# EAGLE design AJH_2v_v1_03 (EAGLE 9.5.2)

## Sheet 1 of 3
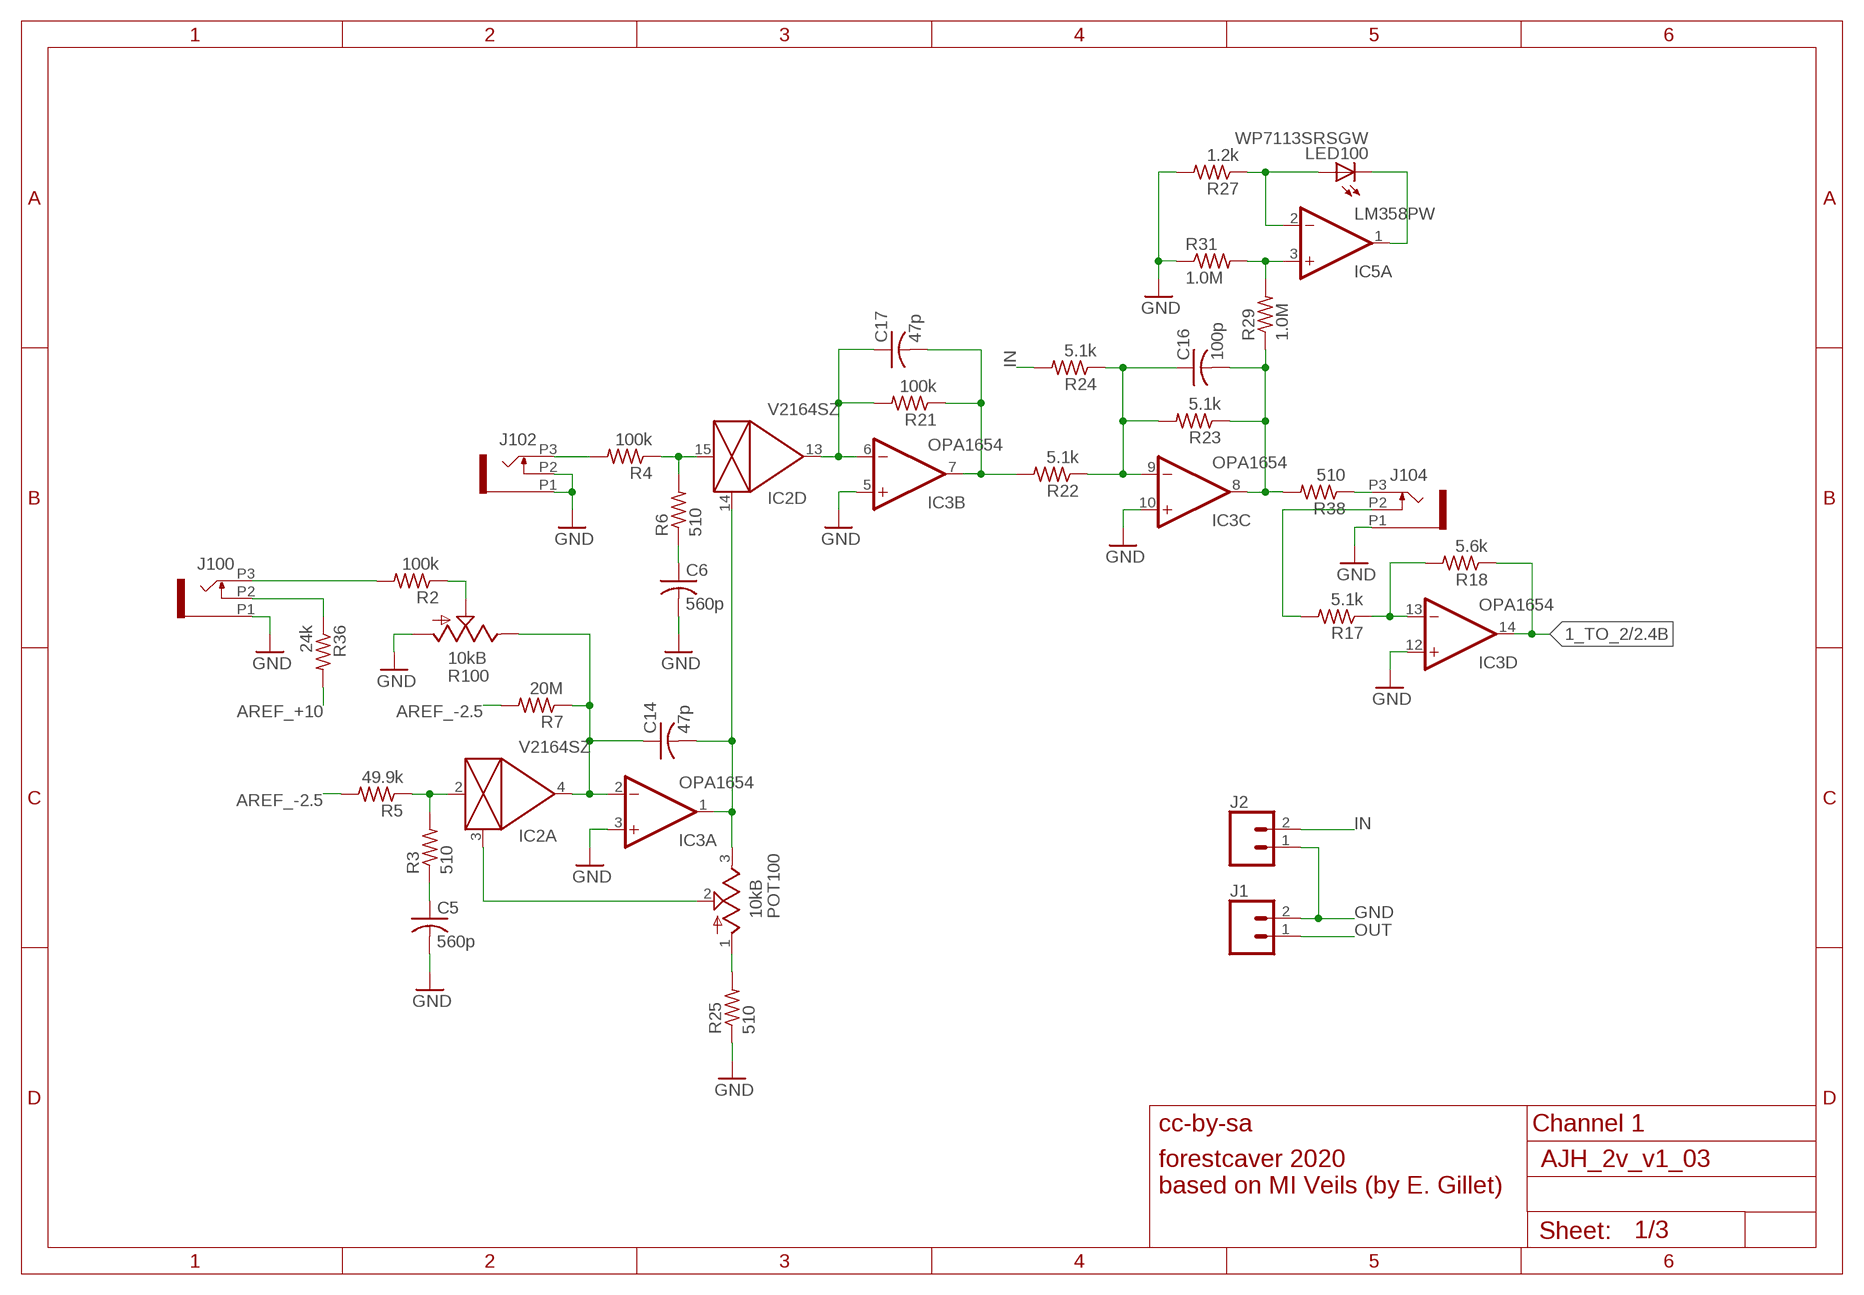
[diagram p0: schematic, sheet 1]

### Parts
C5  560p  C-USC0402  [C0402]
C6  560p  C-USC0402  [C0402]
C14  47p  C-USC0402  [C0402]
C16  100p  C-USC0402  [C0402]
C17  47p  C-USC0402  [C0402]
IC2  V2164SZ  SSM2164S  [SOIC16N]
IC3  OPA1654  TL074PW  [TSSOP14]
IC5  LM358PW  TL072PW  [TSSOP8]
J1  CONN_02  [1X02]
J2  CONN_02  [1X02]
J100  PJ301_THONKICONN6  [WQP_PJ_301M6]
J102  PJ301_THONKICONN6  [WQP_PJ_301M6]
J104  PJ301_THONKICONN6  [WQP_PJ_301M6]
LED100  WP7113SRSGW  LED5MM  [LED5MM]
POT100  10kB  POT_VERTICALNOHOLE  [ALPS_POT_NOHOLE]
R2  100k  R-US_R0402  [R0402]
R3  510  R-US_R0402  [R0402]
R4  100k  R-US_R0402  [R0402]
R5  49.9k  R-US_R0402  [R0402]
R6  510  R-US_R0402  [R0402]
R7  20M  R-US_R0402  [R0402]
R17  5.1k  R-US_R0402  [R0402]
R18  5.6k  R-US_R0402  [R0402]
R21  100k  R-US_R0402  [R0402]
R22  5.1k  R-US_R0402  [R0402]
R23  5.1k  R-US_R0402  [R0402]
R24  5.1k  R-US_R0402  [R0402]
R25  510  R-US_R0402  [R0402]
R27  1.2k  R-US_R0402  [R0402]
R29  1.0M  R-US_R0402  [R0402]
R31  1.0M  R-US_R0402  [R0402]
R36  24k  R-US_R0402  [R0402]
R38  510  R-US_R0402  [R0402]
R100  10kB  POT_USVERTICAL_PS  [ALPS_POT_VERTICAL_PS]

### Nets
1_TO_2: IC3.14(D:OUT) R18.1 ; also sheet 2
AREF_+10: R36.2 ; also sheet 2,3
AREF_-2.5: R5.2 R7.2 ; also sheet 2,3
CV_IN_1: J100.P3 R2.2
FOO: IC2.2(A:IN) R3.2 R5.1
GND: C5.2 C6.2 IC3.3(A:+IN) IC3.5(B:+IN) IC3.10(C:+IN) IC3.12(D:+IN) J1.2 J2.1 J100.P1 J102.P1 J102.P2 J104.P1 R25.1 R27.2 R31.1 R100.P$3(A) ; also sheet 2,3
IN: J2.2 R24.2
N$1: IC5.3(A:+IN) R29.2 R31.2
N$7: J104.P3 R38.1
N$9: IC2.3(A:CTRL) POT100.2(W)
N$10: C16.1 IC3.9(C:-IN) R22.1 R23.2 R24.1
N$14: R2.1 R100.P$2(S)
N$15: POT100.1(A) R25.2
N$18: IC5.1(A:OUT) LED100.K(C)
N$19: IC5.2(A:-IN) LED100.A R27.1
N$20: C5.1 R3.1
N$21: J100.P2 R36.1
N$22: IC3.13(D:-IN) R17.1 R18.2
N$25: J104.P2 R17.2
N$47: C6.1 R6.1
N$65: C14.1 IC2.4(A:OUT) IC3.2(A:-IN) R7.1 R100.P$1(E)
N$66: J102.P3 R4.2
N$75: IC2.15(D:IN) R4.1 R6.2
N$87: C14.2 IC2.14(D:CTRL) IC3.1(A:OUT) POT100.3(B)
N$96: C17.1 IC2.13(D:OUT) IC3.6(B:-IN) R21.2
N$100: C17.2 IC3.7(B:OUT) R21.1 R22.2
OUT: J1.1 ; also sheet 2
OUT1: C16.2 IC3.8(C:OUT) R23.1 R29.1 R38.2

### Notes on the sheet
- cc-by-sa | Channel 1
- forestcaver 2020
  based on MI Veils (by E. Gillet)

## Sheet 2 of 3
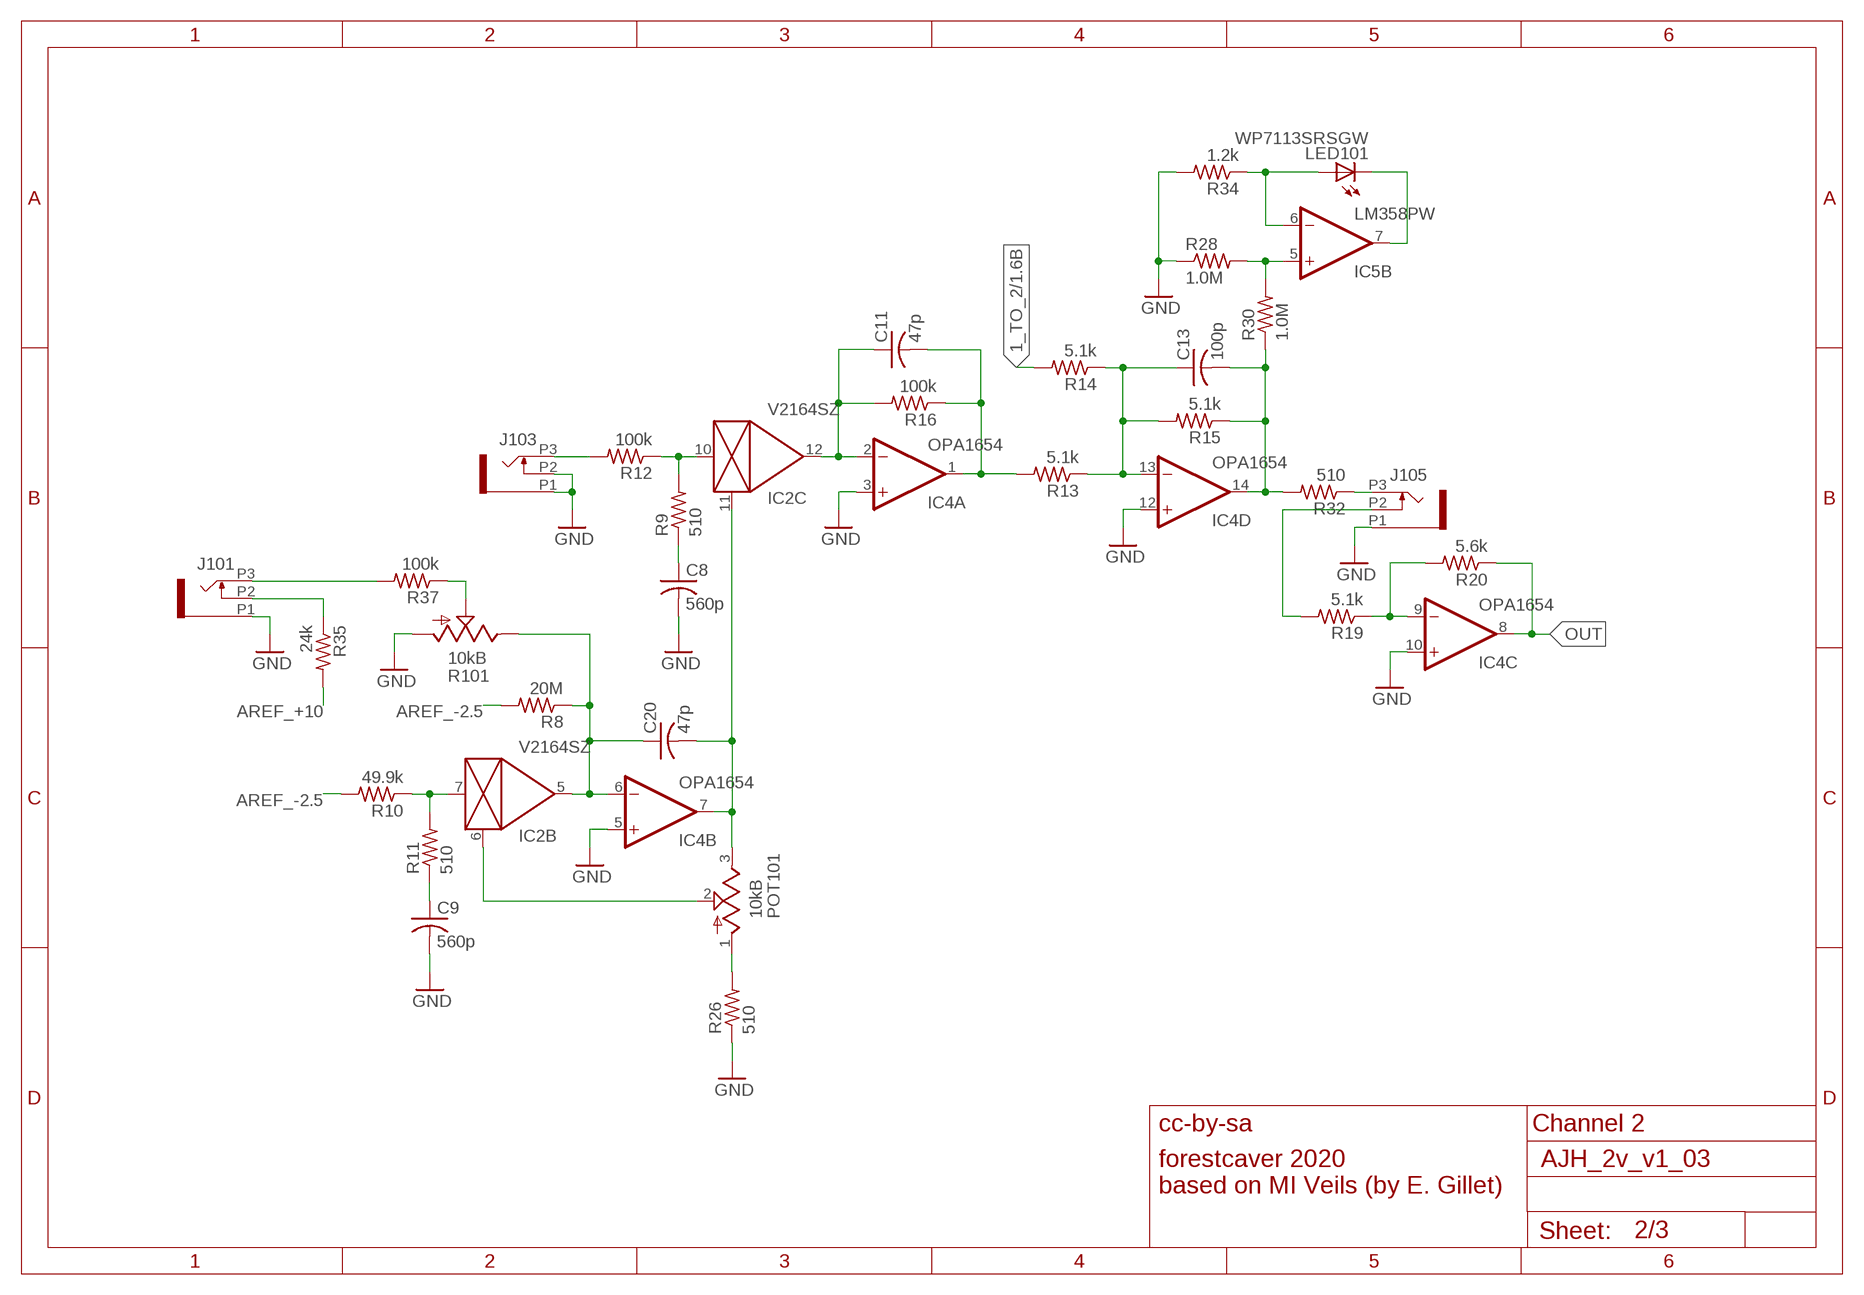
[diagram p1: schematic, sheet 2]

### Parts
C8  560p  C-USC0402  [C0402]
C9  560p  C-USC0402  [C0402]
C11  47p  C-USC0402  [C0402]
C13  100p  C-USC0402  [C0402]
C20  47p  C-USC0402  [C0402]
IC4  OPA1654  TL074PW  [TSSOP14]
J101  PJ301_THONKICONN6  [WQP_PJ_301M6]
J103  PJ301_THONKICONN6  [WQP_PJ_301M6]
J105  PJ301_THONKICONN6  [WQP_PJ_301M6]
LED101  WP7113SRSGW  LED5MM  [LED5MM]
POT101  10kB  POT_VERTICALNOHOLE  [ALPS_POT_NOHOLE]
R8  20M  R-US_R0402  [R0402]
R9  510  R-US_R0402  [R0402]
R10  49.9k  R-US_R0402  [R0402]
R11  510  R-US_R0402  [R0402]
R12  100k  R-US_R0402  [R0402]
R13  5.1k  R-US_R0402  [R0402]
R14  5.1k  R-US_R0402  [R0402]
R15  5.1k  R-US_R0402  [R0402]
R16  100k  R-US_R0402  [R0402]
R19  5.1k  R-US_R0402  [R0402]
R20  5.6k  R-US_R0402  [R0402]
R26  510  R-US_R0402  [R0402]
R28  1.0M  R-US_R0402  [R0402]
R30  1.0M  R-US_R0402  [R0402]
R32  510  R-US_R0402  [R0402]
R34  1.2k  R-US_R0402  [R0402]
R35  24k  R-US_R0402  [R0402]
R37  100k  R-US_R0402  [R0402]
R101  10kB  POT_USVERTICAL_PS  [ALPS_POT_VERTICAL_PS]

### Nets
1_TO_2: R14.2 ; also sheet 1
AREF_+10: R35.2 ; also sheet 1,3
AREF_-2.5: R8.2 R10.2 ; also sheet 1,3
FOO1: IC2.7(B:IN) R10.1 R11.2
GND: C8.2 C9.2 IC4.3(A:+IN) IC4.5(B:+IN) IC4.10(C:+IN) IC4.12(D:+IN) J101.P1 J103.P1 J103.P2 J105.P1 R26.1 R28.1 R34.2 R101.P$3(A) ; also sheet 1,3
N$3: J103.P3 R12.2
N$4: IC5.5(B:+IN) R28.2 R30.2
N$6: J105.P3 R32.1
N$17: C8.1 R9.1
N$24: IC2.10(C:IN) R9.2 R12.1
N$26: IC2.6(B:CTRL) POT101.2(W)
N$27: C13.1 IC4.13(D:-IN) R13.1 R14.1 R15.2
N$28: C20.2 IC2.11(C:CTRL) IC4.7(B:OUT) POT101.3(B)
N$32: POT101.1(A) R26.2
N$35: IC5.7(B:OUT) LED101.K(C)
N$36: IC5.6(B:-IN) LED101.A R34.1
N$37: IC4.9(C:-IN) R19.1 R20.2
N$38: J105.P2 R19.2
N$39: C11.2 IC4.1(A:OUT) R13.2 R16.1
N$40: R37.1 R101.P$2(S)
N$41: C9.1 R11.1
N$42: C20.1 IC2.5(B:OUT) IC4.6(B:-IN) R8.1 R101.P$1(E)
N$44: J101.P3 R37.2
N$53: C11.1 IC2.12(C:OUT) IC4.2(A:-IN) R16.2
N$64: J101.P2 R35.1
OUT: IC4.8(C:OUT) R20.1 ; also sheet 1
OUT2: C13.2 IC4.14(D:OUT) R15.1 R30.1 R32.2

### Notes on the sheet
- cc-by-sa | Channel 2
- forestcaver 2020
  based on MI Veils (by E. Gillet)

## Sheet 3 of 3
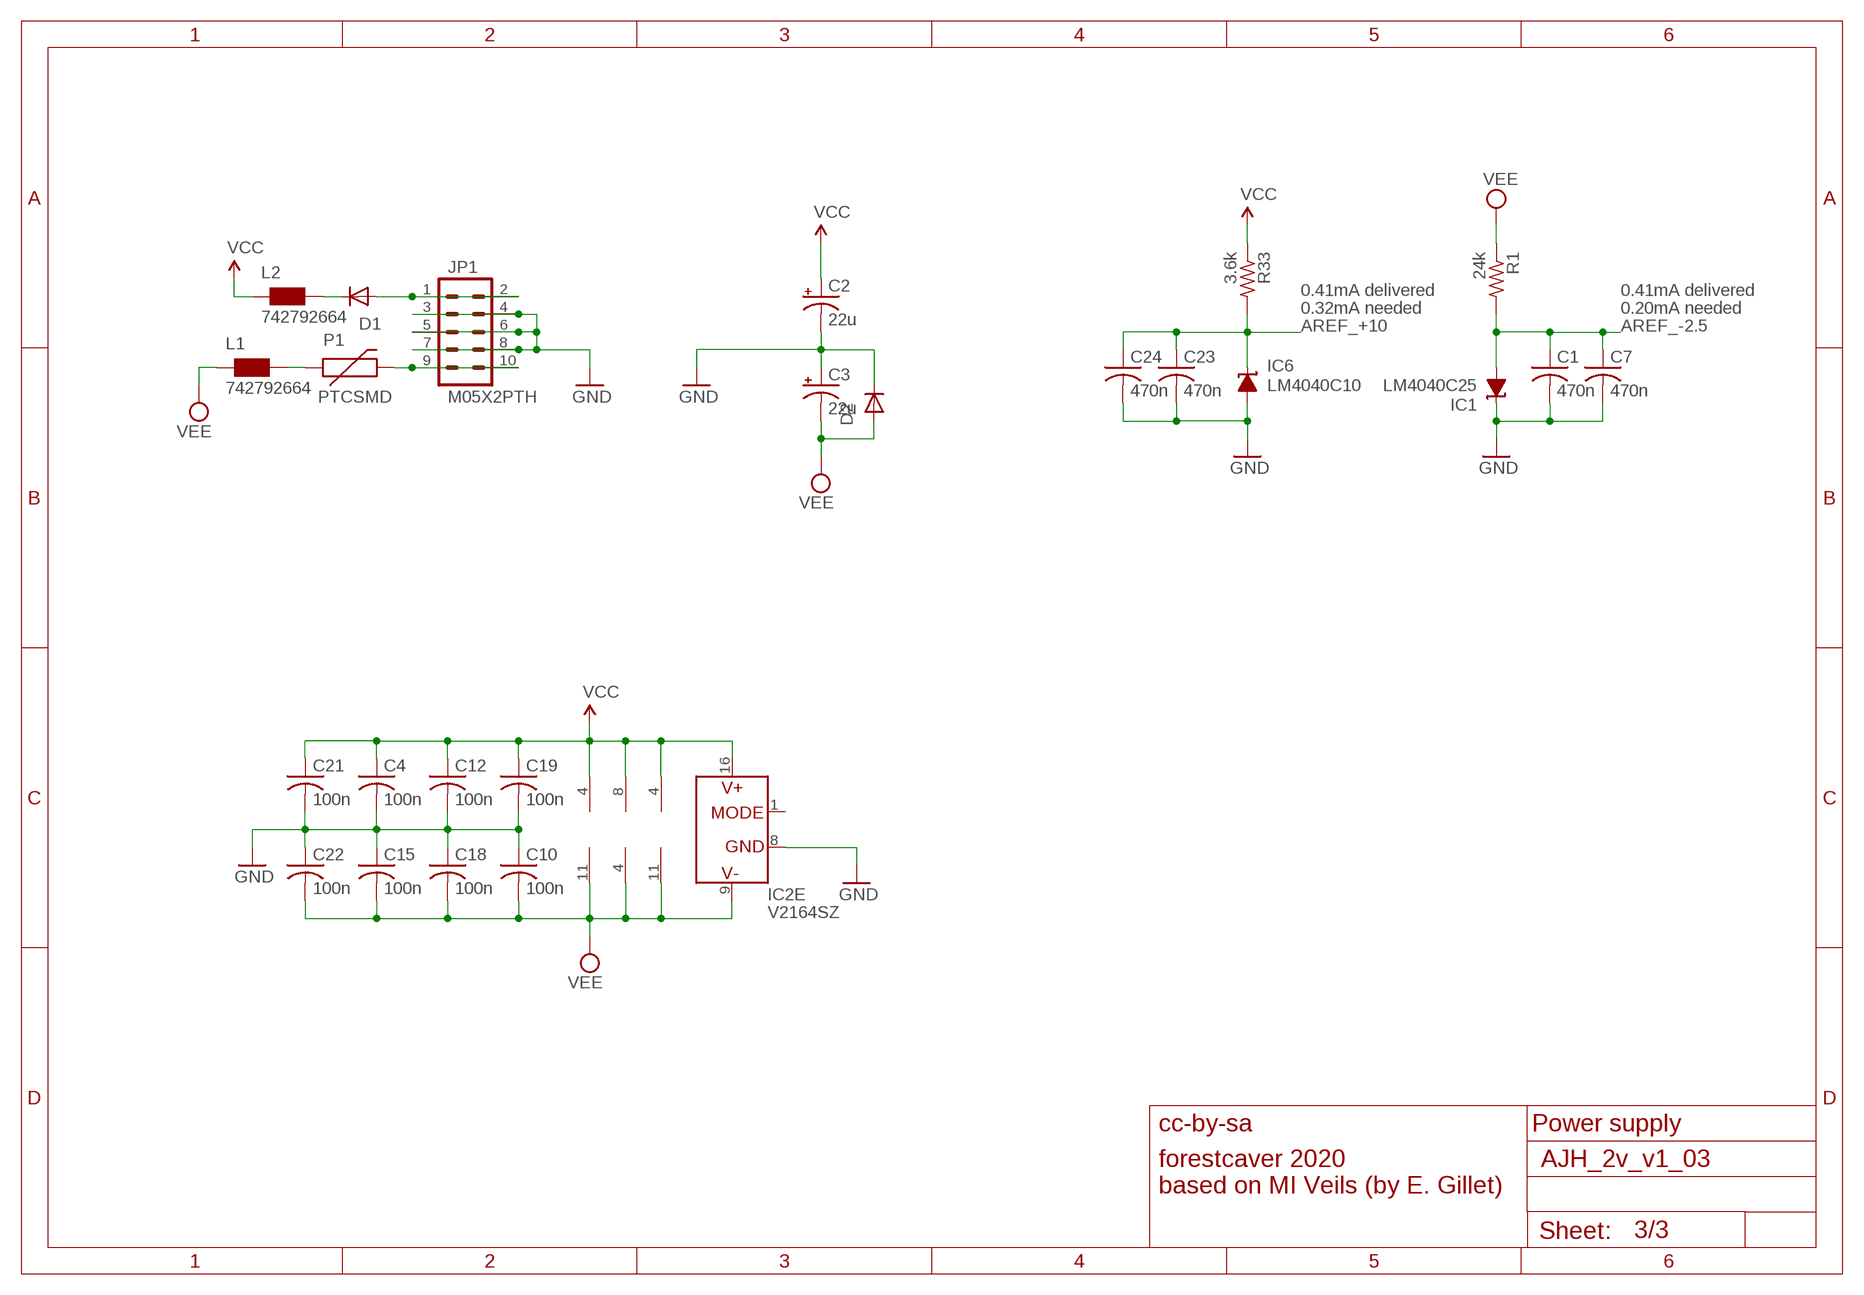
[diagram p2: schematic, sheet 3]

### Parts
C1  470n  C-USC0402  [C0402]
C2  22u  CPOL-USB  [PANASONIC_B]
C3  22u  CPOL-USB  [PANASONIC_B]
C4  100n  C-USC0402  [C0402]
C7  470n  C-USC0402  [C0402]
C10  100n  C-USC0402  [C0402]
C12  100n  C-USC0402  [C0402]
C15  100n  C-USC0402  [C0402]
C18  100n  C-USC0402  [C0402]
C19  100n  C-USC0402  [C0402]
C21  100n  C-USC0402  [C0402]
C22  100n  C-USC0402  [C0402]
C23  470n  C-USC0402  [C0402]
C24  470n  C-USC0402  [C0402]
D1  1N5819HW  DIODE-SOD123  [SOD123]
D2  1N5819HW  DIODE-SOD123  [SOD123]
IC1  LM4040C25  LM4041B12DBZ  [DBZ_R-PDSO-G3]
IC6  LM4040C10  LM4041B12DBZ  [DBZ_R-PDSO-G3]
JP1  M05X2PTH  [AVR_ICSP]
L1  742792664  WE-CBF_0603  [0603]
L2  742792664  WE-CBF_0603  [0603]
P1  PTCSMD  [PTC-1206]
R1  24k  R-US_R0402  [R0402]
R33  3.6k  R-US_R0402  [R0402]

### Nets
AREF_+10: C23.1 C24.1 IC6.1(C) R33.2 ; also sheet 1,2
AREF_-2.5: C1.1 C7.1 IC1.2(A) R1.2 ; also sheet 1,2
GND: C1.2 C2.- C3.+ C4.2 C7.2 C10.1 C12.2 C15.1 C18.1 C19.2 C21.2 C22.1 C23.2 C24.2 D2.C IC1.1(C) IC2.8(E:GND) IC6.2(A) JP1.3 JP1.4 JP1.5 JP1.6 JP1.7 JP1.8 ; also sheet 1,2
N$11: D1.A JP1.1 JP1.2
N$12: JP1.9 JP1.10 P1.2
N$13: L1.2 P1.1
N$16: D1.C L2.2
VCC: C2.+ C4.1 C12.1 C19.1 C21.1 IC2.16(E:V+) IC3.4(P:V+) IC4.4(P:V+) IC5.8(P:V+) L2.1 R33.1
VEE: C3.- C10.2 C15.2 C18.2 C22.2 D2.A IC2.9(E:V-) IC3.11(P:V-) IC4.11(P:V-) IC5.4(P:V-) L1.1 R1.1
Unconnected: IC2.1(E:MODE)

### Notes on the sheet
- 0.41mA delivered | 0.41mA delivered
- 0.32mA needed | 0.20mA needed
- cc-by-sa | Power supply
- forestcaver 2020
  based on MI Veils (by E. Gillet)

## Library data of the parts
C1 C4-C24 = rcl:C-US: CAPACITOR, American symbol
C2 C3 = rcl:CPOL-US: POLARIZED CAPACITOR, American symbol
D1 D2 = diode:DIODE-: DIODE
IC1 IC6 = texas:LM4041: PRECISION MICROPOWER SHUNT VOLTAGE REFERENCE Source: http://focus.ti.com/lit/ds/slcs146e/slcs146e.pdf
IC2 = ssm2164:SSM2164
IC3 IC4 = linear:TL074: OP AMP
IC5 = linear:TL072: OP AMP
J1 J2 = SparkFun-Connectors:CONN_02: Multi connection point. Often used as Generic Header-pin footprint for 0.1 inch spaced/style header connections On any of the 0.1 inch spaced packages, you can populate with these: Break Away Headers - Straight <https://www.sparkfun.com/products/116> (PRT-00116) Break Away Male Headers - Right Angle <https://www.sparkfun.com/products/553> (PRT-00553) Female Headers <https://www.sparkfun.com/products/115> (PRT-00115) Break Away Headers - Machine Pin <https://www.sparkfun.com/products/117> (PRT-00117) Break Away Female Headers - Swiss Machine Pin <https://www.sparkfun.com/products/743> (PRT-00743) For SCREWTERMINALS and SPRING TERMINALS visit here: Screw Terimnals on SparkFun.com <https://www.sparkfun.com/search/results?term=Screw+Terminals> (5mm/3.5mm/2.54mm spacing) This device is also useful as a general connection point to wire up your design to another part of your project. Our various solder wires solder well into these plated through hole pads. Hook-Up Wire - Assortment (Stranded, 22 AWG) <https://www.sparkfun.com/products/11375> (PRT-11375) Hook-Up Wire - Assortment (Solid Core, 22 AWG) <https://www.sparkfun.com/products/11367> (PRT-11367) View the entire wire category on our website here <https://www.sparkfun.com/categories/141> Special notes: Molex polarized connector foot print use with: PRT-08233 with associated crimp pins and housings. 2.54_SCREWTERM for use with PRT-10571. 3.5mm Screw Terminal footprints for PRT-08084 5mm Screw Terminal footprints for use with PRT-08432
J100-J105 = og-pj301:PJ301_THONKICONN
JP1 = og-header:M05X2: Header 5x2 Standard 10-pin dual row 0.1" header. Commonly used with AVR-ISP. Use with Spark Fun Electronics SKU: PRT-00778
L1 L2 = wuerth-elektronik:WE-CBF: SMD EMI Suppression Ferrite Beads - excellent anti-EMI properties - low DCR - impedances till 3000 ohms - rated current up to 6 A
LED100 LED101 = led:LED: LED OSRAM: - CHIPLED LG R971, LG N971, LY N971, LG Q971, LY Q971, LO R971, LY R971 LH N974, LH R974 LS Q976, LO Q976, LY Q976 LO Q996 - Hyper CHIPLED LW Q18S LB Q993, LB Q99A, LB R99A - SideLED LS A670, LO A670, LY A670, LG A670, LP A670 LB A673, LV A673, LT A673, LW A673 LH A674 LY A675 LS A676, LA A676, LO A676, LY A676, LW A676 LS A679, LY A679, LG A679 - Hyper Micro SIDELED® LS Y876, LA Y876, LO Y876, LY Y876 LT Y87S - SmartLED LW L88C, LW L88S LB L89C, LB L89S, LG L890 LS L89K, LO L89K, LY L89K LS L896, LA L896, LO L896, LY L896 - TOPLED LS T670, LO T670, LY T670, LG T670, LP T670 LSG T670, LSP T670, LSY T670, LOP T670, LYG T670 LG T671, LOG T671, LSG T671 LB T673, LV T673, LT T673, LW T673 LH T674 LS T676, LA T676, LO T676, LY T676, LB T676, LH T676, LSB T676, LW T676 LB T67C, LV T67C, LT T67C, LS T67K, LO T67K, LY T67K, LW E67C LS E67B, LA E67B, LO E67B, LY E67B, LB E67C, LV E67C, LT E67C LW T67C LS T679, LY T679, LG T679 LS T770, LO T770, LY T770, LG T770, LP T770 LB T773, LV T773, LT T773, LW T773 LH T774 LS E675, LA E675, LY E675, LS T675 LS T776, LA T776, LO T776, LY T776, LB T776 LHGB T686 LT T68C, LB T68C - Hyper Mini TOPLED® LB M676 - Mini TOPLED Santana® LG M470 LS M47K, LO M47K, LY M47K Source: http://www.osram.convergy.de LUXEON: - LUMILED® LXK2-PW12-R00, LXK2-PW12-S00, LXK2-PW14-U00, LXK2-PW14-V00 LXK2-PM12-R00, LXK2-PM12-S00, LXK2-PM14-U00 LXK2-PE12-Q00, LXK2-PE12-R00, LXK2-PE12-S00, LXK2-PE14-T00, LXK2-PE14-U00 LXK2-PB12-K00, LXK2-PB12-L00, LXK2-PB12-M00, LXK2-PB14-N00, LXK2-PB14-P00, LXK2-PB14-Q00 LXK2-PR12-L00, LXK2-PR12-M00, LXK2-PR14-Q00, LXK2-PR14-R00 LXK2-PD12-Q00, LXK2-PD12-R00, LXK2-PD12-S00 LXK2-PH12-R00, LXK2-PH12-S00 LXK2-PL12-P00, LXK2-PL12-Q00, LXK2-PL12-R00 Source: www.luxeon.com KINGBRIGHT: KA-3528ASYC Source: www.kingbright.com
P1 = SparkFun:PTC: Resettable Fuse PTC Resettable Fuse. Spark Fun Electronics SKU : COM-08357
POT100 POT101 = parts_aman:POT_VERTICAL
R1-R38 = rcl:R-US_: RESISTOR, American symbol
R100 R101 = pot-alps:POT_US

## Board
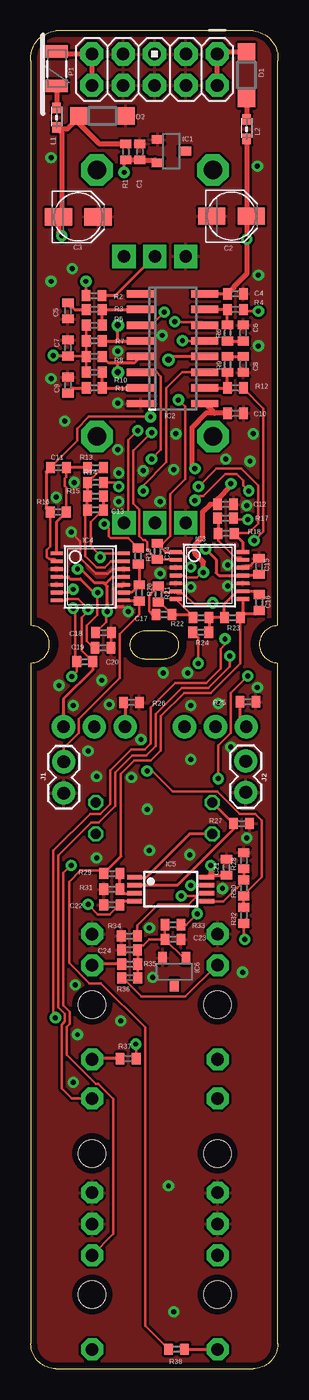
[diagram p3: board, top side]
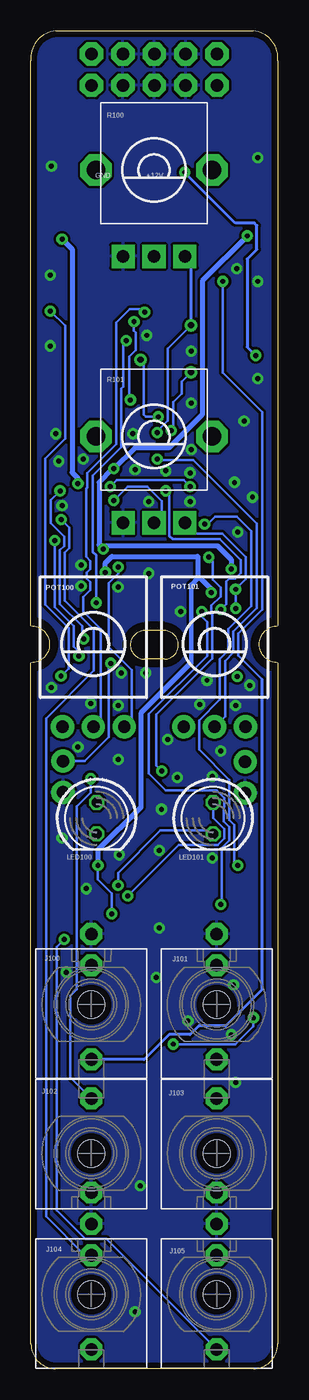
[diagram p4: board, bottom side, seen from below]

Size 20.02 x 108.41 mm. Coordinates in mm from the lower left corner, seen from the top.
Outline: 19.55,57.33 arc-45 19.55,57.33
Outline: 2.01,0 18.01,0 arc90 20.01,2 20.01,57.2 arc-180 20.01,60.2 20.01,106 arc90 18.01,108.41 2.01,108.41 arc90 0.01,106 0.01,60.2 arc-180 0.01,57.2 0.01,2 arc90 2.01,0
Outline: 9.21,57.5 arc-180 9.21,59.8 10.81,59.8 arc-180 10.81,57.5 9.21,57.5
Copper layers (1*16): Top 0.035mm / dielectric 1.5mm / Bottom 0.035mm
Design rules "foo": minimum track width 8mil, minimum drill 0.4mm, track to track 8mil, track to pad 8mil, pad to pad 8mil, via to via 8mil, smd to smd 8mil, copper to edge 20mil, drill to drill 8mil, minimum pad ring 8mil, minimum via ring 10mil, stop-mask expansion 3mil, vias tented up to drill 25mil, thermal gap 8mil
tRestrict: area 9.2,56.9 to 10.8,60.5; area -2.2,56.5 to 2.2,60.9; area 7.4,56.8 to 11,60.5; area 9,56.8 to 12.6,60.5; area 17.8,56.5 to 22.2,60.9; area 9.2,56.8 to 10.8,60.4
bRestrict: area 9.2,56.9 to 10.8,60.5; area 7.4,56.8 to 11,60.5; area 9,56.8 to 12.6,60.5; area 17.8,56.5 to 22.2,60.9; area -2.2,56.5 to 2.2,60.9; area 9.2,56.8 to 10.8,60.4

### Footprints (pad centres in the part's own frame; a part is rotated, then mirrored left to right if it is on the bottom)
C0402 = smd 0.7 x 0.9: 1 -0.65,0; 2 0.65,0
PANASONIC_B = smd 2.2 x 1.4: + 1.6,0; - -1.6,0
SOD123 = smd 1.4 x 1.4: A 1.9,0; C -1.9,0
DBZ_R-PDSO-G3 = smd 0.7 x 1: 1 -0.95,-1.1; 2 0.95,-1.1; 3 0,1.1
SOIC16N = smd 0.6 x 2.2: 1 -4.445,-2.6; 2 -3.175,-2.6; 3 -1.905,-2.6; 4 -0.635,-2.6; 5 0.635,-2.6; 6 1.905,-2.6; 7 3.175,-2.6; 8 4.445,-2.6; 9 4.445,2.6; 10 3.175,2.6; 11 1.905,2.6; 12 0.635,2.6; 13 -0.635,2.6; 14 -1.905,2.6; 15 -3.175,2.6; 16 -4.445,2.6
TSSOP14 = smd 0.305 x 0.991: 1 -1.905,-2.718; 2 -1.27,-2.718; 3 -0.635,-2.718; 4 0,-2.718; 5 0.635,-2.718; 6 1.27,-2.718; 7 1.905,-2.718; 8 1.905,2.718; 9 1.27,2.718; 10 0.635,2.718; 11 0,2.718; 12 -0.635,2.718; 13 -1.27,2.718; 14 -1.905,2.718
TSSOP8 = smd 0.35 x 1.2: 1 -0.975,-2.925; 2 -0.325,-2.925; 3 0.325,-2.925; 4 0.975,-2.925; 5 0.975,2.925; 6 0.325,2.925; 7 -0.325,2.925; 8 -0.975,2.925
1X02 = drill 1.016 pad 1.88: 1 0,0; 2 2.54,0
WQP_PJ_301M6 = drill 1.016 pad 1.778 octagon: P1 0,-5.715; P2 0,-3.175; P3 0,4.445 | hole 2.2: 0,0
AVR_ICSP = drill 1.016 pad 1.88 octagon: 1 -1.27,5.08; 2 1.27,5.08; 3 -1.27,2.54; 4 1.27,2.54; 5 -1.27,0; 6 1.27,0; 7 -1.27,-2.54; 8 1.27,-2.54; 9 -1.27,-5.08; 10 1.27,-5.08
0603 = smd 0.85 x 0.7: 1 -0.9,0; 2 0.7,0
LED5MM = drill 0.813 octagon: A -1.27,0; K 1.27,0
PTC-1206 = smd 1 x 1.8: 1 -1.4,0; 2 1.4,0
ALPS_POT_NOHOLE = drill 1 pad 1.88: 1 -2.5,-6.7; 2 0,-6.7; 3 2.5,-6.7
R0402 = smd 0.7 x 0.9: 1 -0.65,0; 2 0.65,0
ALPS_POT_VERTICAL_PS = drill 1 pad 1.88 square: P$1 -2.5,7; P$2 0,7; P$3 2.5,7 | drill 1.5 pad 2.54 octagon: P$4 -4.7,0; P$5 4.7,0

### Placement (x,y rotation side)
C1  8.84,98.6 90 top
C2  16.26,93.4 0 top
C3  3.84,93.34 0 top
C4  16.57,87.09 0 top
C5  3.01,85.7 270 top
C6  17.2,83.92 90 top
C7  3.01,82.7 90 top
C8  17.2,81.38 270 top
C9  3.01,79.7 90 top
C10  16.59,77.41 180 top
C11  2.23,73.02 0 top
C12  15.77,70.04 0 top
C13  5.23,69.59 0 top
C14  10.25,66.23 90 top
C15  18.48,65.01 270 top
C16  18.5,62.08 270 top
C17  10.79,61.11 0 top
C18  5.88,59.65 180 top
C19  5.86,58.41 0 top
C20  4.36,57.29 0 top
C21  15.85,40.63 90 top
C22  6.56,37.58 0 top
C23  11.51,34.8 0 top
C24  8,33.94 180 top
D1  17.47,104.82 90 top
D2  5.8,101.52 180 top
IC1  11.38,98.66 270 top
IC2  11.49,82.65 270 top
IC3  14.46,64.27 270 top
IC4  4.82,64.16 270 top
IC5  11.32,38.85 270 top
IC6  11.62,32.17 180 top
J1  2.66,49.18 270 top
J2  17.41,46.7 90 top
J100  15.13,29.51 180 bottom
J101  4.97,29.51 180 bottom
J102  15.13,17.44 0 bottom
J103  4.97,17.44 0 bottom
J104  15.13,6.01 180 bottom
J105  4.97,6.01 180 bottom
JP1  10.02,105.26 270 top
L1  2.08,101.46 90 top
L2  17.48,100.53 90 top
LED100  14.7,44.61 270 bottom
LED101  5.26,44.61 270 bottom
P1  2.11,105.33 90 top
POT100  14.95,58.72 0 bottom
POT101  5.14,58.72 0 bottom
R1  7.69,98.6 270 top
R2  5.12,86.94 180 top
R3  5.14,85.82 0 top
R4  16.57,85.82 0 top
R5  5.14,84.55 180 top
R6  15.93,83.92 90 top
R7  5.14,83.28 180 top
R8  5.14,82.01 180 top
R9  15.93,81.38 270 top
R10  5.14,80.74 180 top
R11  5.14,79.47 0 top
R12  16.57,79.47 0 top
R13  5.23,73.02 180 top
R14  5.23,71.82 0 top
R15  5.23,70.7 180 top
R16  2.22,69.41 180 top
R17  15.77,68.92 0 top
R18  15.82,67.68 180 top
R19  8.69,65.85 90 top
R20  8.77,62.86 90 top
R21  10.33,62.77 90 top
R22  13.78,60.87 180 top
R23  16.32,60.87 180 top
R24  13.76,59.67 180 top
R25  17.59,54.04 180 top
R26  8.14,53.99 180 top
R27  17.07,44.17 0 top
R28  17.26,41.17 270 top
R29  6.56,40.12 0 top
R30  17.26,38.95 90 top
R31  6.56,38.85 0 top
R32  17.26,36.73 90 top
R33  11.51,35.97 180 top
R34  7.97,35.06 180 top
R35  8.01,32.78 0 top
R36  8.01,31.67 0 top
R37  7.88,25.12 180 top
R38  11.8,1.58 180 top
R100  10.05,97.13 180 bottom
R101  10.05,75.54 180 bottom

### Tracks (layer width: path | path; a pad name or v marks a point on that pad's centre or on a via)
1_TO_2  (via drill 0.4)
  Top 0.203: R14.2 6.78,71.82 v7.12,71.47 | R18.1 16.51,67.71 17.63,67.71 18.41,68.5 18.41,71.54 17.04,72.92 15.02,72.92 v13.58,71.47
  Top 0.254: R18.1 17.18,66.98 IC3.14
  Bottom 0.203: v7.12,71.47 7.64,71.99 13.07,71.99 v13.58,71.47
AREF_+10
  Top 0.203: R35.2 R36.2 | C23.1 R33.2 | C23.1 12.38,33.27 IC6.1 | C24.1 9.02,34.31 9.1,34.31 9.59,34.8 C23.1
  Top 0.254: 8.65,32.79 R35.2 8.65,32.79 C24.1 | IC6.1 12.5,33.34
AREF_-2.5  (via drill 0.4)
  Top 0.203: C7.1 4.45,82.05 R8.2 | R8.2 R10.2 | R8.2 R7.2 R5.2
  Top 0.254: C7.1 1.86,82.05 v1.81,82.1 | v7.55,96.93 7.55,97.81 R1.2
  Top 0.406: R1.2 C1.1 10.04,97.95 IC1.2
  Bottom 0.254: v1.81,82.1 2.49,82.79 2.49,89.91 1.71,90.69 1.71,92.63 1.91,92.83 3.45,92.83 v7.55,96.93
CV_IN_1  (via drill 0.4)
  Top 0.254: 4.49,86.94 R2.2 4.47,88.09 v4.46,88.1
  Bottom 0.203: 1.31,55.88 3.2,57.78 3.2,59.58 1.28,61.5 1.28,77.51 4.46,80.7 v4.46,88.1
  Bottom 0.254: 1.31,55.88 1.31,30.71 4.25,27.77 6.42,27.77 7.11,27.08 8.82,27.08 10.84,25.06 J100.P3
FOO
  Top 0.254: IC2.2 R3.2 R5.1
FOO1
  Top 0.254: R10.1 R11.2 IC2.7
GND  (via drill 0.4, 0.41)
  Top 0.203: C18.1 6.51,59.63 C19.2 | IC4.12 6.62,64.8 6.25,64.42 5.27,64.42 4.01,65.68 4.01,67.04 v3.26,67.79 | IC3.12 17.35,65.08 17.8,65.08 17.98,65.26 17.98,65.29 18.34,65.66
  Top 0.254: IC4.10 7.38,63.37 6.9,63.37 6.71,63.18 6.71,61.97 6.9,61.77 7.48,61.77 v7.89,61.36
  Top 0.406: 18.34,65.66 C15.1
  other vias: 10.72,56.39 15.18,53.9 5.75,55.79 12.95,49.36 8.92,50.99 3.43,53.73 8.15,47.9 5.32,47.98 11.15,14.81 11.58,4.61 17.15,32.13 9.44,45.33 17.49,43.01 12.86,41.64 9.61,41.98 18.44,88.62 6.35,53.81 2.28,55.37 4.63,50.04 7.29,28.18 3.43,23.21 3.78,27.07 2.75,76.79 1.63,80.22 3.35,89.13 7.04,78.25 18.35,97.45 1.63,98.13 10.64,83.73 11.75,75.76 18.01,75.76 15.78,73.7 10.46,70.27 7.04,74.47 7.12,70.27 9.09,72.76 2.06,70.62 9.86,31.7 9.61,35.73 5.32,41.38 3.61,31.1 15.52,38.9 16.21,50.39 3.52,71.82 11.58,72.84 7.12,72.59 1.63,88.1 7.04,82.45 10.46,64.44 12.95,63.33 17.49,69.93 12.95,53.73 12.69,56.39 18.35,55.19 18.44,82.87 17.75,73.53 15.95,63.42 15.95,65.13
  pour Bottom: 0.01,109.06 0.01,-0.71 19.97,-0.71 19.97,109.06
  pour Top: 0.01,109.08 0.01,-0.71 20.06,-0.71 20.06,109.08
IN  (via drill 0.4)
  Top 0.203: R24.2 13.55,59.23 v13.55,57.16
  Bottom 0.203: J2.2 15.64,49.24 13.71,51.17 13.71,56.83 13.55,56.99 v13.55,57.16
N$1
  Top 0.254: R29.2 R31.2 7.53,38.53 IC5.3
N$3  (via drill 0.4)
  Top 0.203: R12.2 17.22,79.44 18.84,77.81 18.84,67.82 18.13,67.1 v18.08,67.1 | v16.12,57.76 16.12,56.92 14.37,55.16 12.23,55.16 10.12,53.05 10.12,50.44 9.35,49.68 8.2,49.68 6.83,48.31 6.83,45.58 5.5,44.25 4.88,44.25 2.24,41.6 2.24,29.27 2.75,28.75 2.75,28.12 2.49,27.87 2.49,22.7 3.3,21.89 J103.P3
  Bottom 0.203: v18.08,67.1 18.08,61.72 16.55,60.18 16.55,58.53 16.12,58.1 v16.12,57.76
N$4
  Top 0.203: 17.26,39.5 16.72,38.96 16.68,38.96 15.6,37.88 IC5.5
  Top 0.254: R28.2 R30.2 17.26,39.5 17.26,39.34 | 13.93,37.88 IC5.5 14.27,37.85
N$6  (via drill 0.4)
  Top 0.203: R32.1 17.26,34.85 v17.32,34.78
  Top 0.254: R32.1 17.24,36.09
  Bottom 0.203: J105.P3 13.93,10.53 15.62,10.53 17.92,12.83 17.92,34.18 v17.32,34.78
N$7
  Top 0.254: R38.1 12.46,1.57 J104.P3
N$9  (via drill 0.4)
  Top 0.203: IC2.3 8.92,84.59 9.78,84.59 v10.81,85.62
  Bottom 0.203: POT100.2 14.35,52.62 14.35,59.92 15.77,61.34 15.77,62.52 15.19,63.1 15.19,63.73 15.5,64.04 15.5,64.51 15.19,64.82 15.19,65.44 15.54,65.79 15.54,71.32 15.45,71.42 15.45,72.57 13.12,74.9 13.12,84.76 12.01,85.87 11.06,85.87 v10.81,85.62
N$10
  Top 0.254: C16.1 18.23,63 IC3.9 17.16,63.02 16.72,63.02 15.67,61.98 R23.2 R22.1 14.43,59.69 R24.1
N$11
  Top 0.406: D1.A 15.29,106.72 JP1.1 JP1.2
N$12
  Top 0.406: JP1.10 JP1.9 2.31,106.53 P1.2
N$13
  Top 0.406: P1.1 2.11,102.19 L1.2
N$14
  Top 0.254: R100.P$2 6.85,86.94 R2.1
N$15
  Top 0.254: R25.2 16.94,52.53 POT100.1
N$16
  Top 0.406: D1.C L2.2
N$17
  Top 0.254: R9.1 C8.1
N$18
  Top 0.254: IC5.1 8.42,39.8 9.33,39.8 12.86,43.34 LED100.K
N$19
  Top 0.254: IC5.2 11.86,39.17 16.42,43.73 R27.1 16.4,44.17 LED100.A
N$20
  Top 0.254: C5.1 3.54,85.82 R3.1
N$21
  Top 0.203: J100.P2 15.06,32.68 12.53,30.15 8.96,30.15 7.43,31.67 R36.1
N$22
  Top 0.203: IC3.13 17,65.72 16.56,65.72 15.17,67.1 R18.2
  Top 0.254: R17.1 15.17,68.87 R18.2
N$24
  Top 0.254: R9.2 15.92,80.71 R12.1 IC2.10
N$25  (via drill 0.4)
  Top 0.203: v17.57,68.82 16.53,68.82 R17.2
  Bottom 0.203: J104.P2 15.64,9.19 18.78,12.33 18.78,52.7 14.92,56.56 14.92,59.88 17.27,62.23 17.27,66.15 16.92,66.5 16.92,68.16 v17.57,68.82
N$26  (via drill 0.4)
  Top 0.203: v9.78,73.7 10.53,74.46 10.53,80.4 10.19,80.74 IC2.6
  Bottom 0.203: v9.78,73.7 9.69,73.62 6.88,73.62 1.72,68.46 1.72,61.64 3.61,59.75 3.61,58.01 4.29,57.33 4.29,52.86 POT101.2
N$27
  Top 0.203: 6.51,65.43 5.99,64.92 5.35,64.92 4.41,65.85 4.41,69.42 C13.1 | R14.1 5.03,72.26 5.06,72.26 5.82,73.02 R13.1
  Top 0.254: C13.1 R15.2 R14.1 | 6.51,65.43 IC4.13
N$28  (via drill 0.4)
  Top 0.203: 2.14,62.21 IC4.7 2.83,62.26 2.95,62.37 3.84,62.37 4.63,61.58 v4.63,61.52 4.63,61.4 4.1,60.87 4.1,58.2 C20.2 | IC2.11 12.28,80.74 10.98,79.45 10.98,73.44 9.09,71.56 v9.09,71.13
  Top 0.254: C20.2 5.01,56.62 2.64,54.24 POT101.3
  Bottom 0.203: v9.09,71.13 8.8,70.84 8.8,67.49 8.53,67.21 4.7,67.21 3.02,65.53 3.02,64.47 3.46,64.03 3.95,64.03 4.19,63.78 4.19,61.96 v4.63,61.52
N$32
  Top 0.254: R26.2 7.64,53.84 POT101.1
N$35  (via drill 0.4)
  Top 0.203: IC5.7 14.22,39.15 v12.95,39.15
  Bottom 0.203: v12.95,39.15 12.95,40.18 9.54,43.59 5.52,43.59 LED101.K
N$36  (via drill 0.4)
  Top 0.203: R34.1 8.63,35.92 10.32,37.61 12.78,37.61 13.46,38.3 | IC5.6 13.69,38.53 13.46,38.3 | v12.18,38.3 13.46,38.3
  Top 0.254: IC5.6
  Bottom 0.203: v12.18,38.3 8.05,42.42 4.88,42.42 4.35,42.96 4.35,43.72 5.26,44.63 LED101.A
N$37
  Top 0.254: IC4.9 7.55,62.91 8.17,62.91 R20.2 8.77,65.11 R19.1
N$38  (via drill 0.4)
  Top 0.203: R19.2 7.89,67.3 6.48,67.3 6.3,67.48 6.3,68.09 v5.95,68.45 | J105.P2 6.69,10.91 6.69,16.35 6.68,16.37 6.68,21.86 5.46,23.08 5.26,23.08 2.91,25.43 2.91,27.71 3.16,27.96 3.16,28.92 2.64,29.44 2.64,40.16 v3.26,40.78
  Bottom 0.203: v5.95,68.45 5.69,68.45 5.09,69.05 3.32,69.05 2.15,67.87 2.15,61.78 4.01,59.92 4.01,58.21 4.7,57.52 4.7,54.21 6.39,52.52 6.39,50.17 3.94,47.72 3.94,44.46 3.53,44.05 3.53,41.05 v3.26,40.78
N$39
  Top 0.203: R16.1 2.89,69.43 2.89,71.38 2.76,71.5 2.76,72.13 2.89,72.25 C11.2
  Top 0.254: R13.2 C11.2 | IC4.1 2.1,68.65 R16.1
N$40  (via drill 0.4)
  Top 0.203: v13.29,70.36 13.65,70.71 13.97,70.71 15.74,72.49 16.69,72.49 17.22,71.96 17.22,71.56 v17.66,71.13 | v15.73,59.14 15.73,58.69 15.36,58.33 15.36,56.73 14.2,55.57 11.71,55.57 9.71,53.57 9.71,50.64 9.24,50.17 8.11,50.17 6.43,48.48 6.43,45.75 5.64,44.96 4.81,44.96 1.83,41.98 1.83,28.6 v1.99,28.44 | v8.49,26.3 8.53,26.26 R37.1
  Bottom 0.203: 9.79,68.8 R101.P$2 9.44,69.15 9.44,69.8 9.42,69.79 9.42,70.32 10.57,71.47 12.18,71.47 v13.29,70.36 | v15.73,59.14 15.88,59.29 15.88,60.17 17.68,61.97 17.68,66.32 17.32,66.67 17.32,67.42 18.41,68.5 18.41,70.37 v17.66,71.13 | v1.99,28.44 1.99,27.75 3.45,26.3 v8.49,26.3
N$41
  Top 0.254: C9.1 3.43,79.47 R11.1
N$42  (via drill 0.4, 0.5)
  Top 0.203: v3.31,56.1 3.71,56.5 C20.1 3.61,57.39 3.61,61.43 v3.43,61.61 | R101.P$1 7.89,68.89 7.89,75.26 v8.65,76.02 | IC4.6 3.17,62.89 v3.44,63.16
  Top 0.254: IC2.5 8.37,81.5 7.04,81.5 | 7.04,81.5 6.3,81.5 R8.1 | v7.04,80.74 7.04,81.5
  Bottom 0.203: v8.65,76.02 8.48,76.19 8.48,78.33 7.81,79 7.81,79.97 v7.04,80.74 | R101.P$1 6.69,67.69 4.52,67.69 2.61,65.78 2.61,63.98 v3.44,63.16 v3.44,61.61 v3.43,61.61
N$44
  Top 0.254: R37.2 5.03,25.12 J101.P3
N$47
  Top 0.254: R6.1 C6.1
N$53  (via drill 0.4, 0.5)
  Top 0.203: C11.1 3.77,75.2 3.77,76.2 4.71,77.13 v9.69,77.13 | IC4.2 1.92,65.61 1.48,65.61 1.3,65.79 1.3,66.34 1.57,66.61 R16.2
  Top 0.254: IC2.12 11.4,82.01 v11.14,81.76 | R16.2 1.24,69.74 1.24,72.67 C11.1
  Bottom 0.203: v11.14,81.76 10.89,81.5 10.89,77.3 10.72,77.13 v9.69,77.13
N$64
  Top 0.254: 7.38,32.79 R35.1 5.06,32.78 J101.P2
N$65  (via drill 0.4, 0.5)
  Top 0.203: v9.78,75.85 9.73,75.85 8.29,74.41 8.29,70.1 8.61,69.79 8.79,69.61 8.79,67.46 9.09,67.16 9.26,67.16 9.44,66.98 9.44,66.38 C14.1 11.71,65.58
  Top 0.254: 11.71,65.58 IC3.2 | R7.1 7.04,83.28 | 7.04,83.28 IC2.4 | 7.04,83.28 v7.04,84.55
  Bottom 0.203: v9.78,75.85 9.78,75.98 8.93,76.82 8.93,82.66 v7.04,84.55
  Bottom 0.254: v7.04,84.55 7.04,89.63 R100.P$1
N$66  (via drill 0.4)
  Top 0.203: 17.22,85.79 R4.2 17.34,85.7 v18.44,85.7 | v15.18,47.81 15.18,50.48 16.2,51.5 16.2,54.75 v17.58,56.13
  Bottom 0.203: v17.58,56.13 16.95,56.75 16.95,60.01 18.84,61.9 18.84,73.76 17.24,75.36 17.24,84.5 v18.44,85.7 | v15.18,47.81 15.18,46.69 16.32,45.55 16.32,30.73 16.84,30.21 16.84,23.6 J102.P3
N$75
  Top 0.254: IC2.15 R4.1 15.92,84.58 R6.2
N$87  (via drill 0.4)
  Top 0.203: C14.2 10.69,66.88 11.29,67.48 11.29,70.88 12.51,72.1 12.51,77.95 v11.95,78.5 | v11.66,84.85 11.7,84.81 13.83,84.81 IC2.14 | v12.94,64.95 12.54,65.35 12.54,65.82 12.18,66.18 IC3.1
  Top 0.254: C14.2 10.95,66.18 IC3.1
  Bottom 0.203: 11.7,84.81 v11.66,84.85 11.66,84.1 11.53,83.96 11.53,82.52 12.04,82.01 12.04,78.5 v11.95,78.5 | v12.94,64.95 12.94,64.44 13.71,63.66 13.71,58.48 11.85,56.61 11.85,52.62 POT100.3
N$96  (via drill 0.4)
  Top 0.203: IC2.13 12.28,83.28 v12.28,83.3 | v14.73,62.06 14.56,61.88 13.3,61.88 12.36,62.82 11.92,62.82 IC3.6 11.64,62.9 10.81,62.9 10.33,63.38 R21.2 9.58,62.67 9.58,61.39 9.85,61.11 C17.1
  Bottom 0.203: v12.28,83.3 12.54,83.05 12.54,79.59 12.71,79.42 12.71,74.66 15,72.37 15,66.19 14.74,65.93 14.74,63.62 14.73,63.61 v14.73,62.06
N$100
  Top 0.203: C17.2 10.43,62.12 R21.1 | IC3.7 13.06,61.05 13.06,60.94
  Top 0.254: C17.2 12.89,61.11 13.06,60.94 R22.2
OUT
  Top 0.203: 8.73,62.17 R20.1 8.77,61.12 7.19,59.54 7.19,55.96 3.88,52.65 3.88,51.5 2.66,50.28 J1.1
  Top 0.254: IC4.8 7.91,62.26 7.96,62.21 R20.1 8.79,62.22
OUT1
  Top 0.203: 7.3,41.51 7.3,48.19 8.38,49.27 9.69,49.27 10.52,50.1 10.52,52.87 12.41,54.76 14.58,54.76 16.97,57.14 R23.1 | R38.2 9.25,3.48 9.25,27.64 5.67,31.22 4.74,31.22 3.09,32.87 3.09,39.46 4.01,40.38 5.65,40.38 R29.1
  Top 0.254: 7.3,41.51 R29.1 | C16.2 18.2,61.14 17.24,61.14 R23.1 17.18,61.07 IC3.8
OUT2  (via drill 0.4)
  Top 0.203: 17.26,38.04 17.26,38.37 18.72,39.83 18.72,44.41 18.19,44.93 16.94,44.93 15.08,46.79 11.49,46.79 9.84,48.43 v9.42,48.43 | IC4.14 5.93,66.07 v5.62,65.76 5.62,65.9 4.85,66.67 4.85,68.59 5.5,69.24 5.89,69.24
  Top 0.254: 17.24,37.36 R32.2 17.26,38.04 R30.1 | 5.89,69.24 C13.2 R15.1
  Bottom 0.203: v5.62,65.76 5.28,65.41 5.28,63.93 4.65,63.3 4.65,62.59 5.39,61.85 5.39,61.21 5.34,61.16 5.34,57.53 9.84,53.03 9.84,48.86 v9.42,48.43
VCC  (via drill 0.4)
  Top 0.203: R33.1 12.58,35.97 v13.47,36.86 | IC3.4 12.46,64.27 12.63,64.11 13.43,64.11 13.85,64.53 v13.98,64.53 | 5.04,58.41 C19.1 5.06,58.41 4.51,58.96 4.51,60.21 5.39,61.08 5.39,62.88 v5.41,62.9
  Top 0.254: C4.1 IC2.16 | IC5.8 14.4,39.97 14.58,39.97 C21.1 | IC4.4 3.03,64.16 3.19,64 4,64 5.03,62.98 5.33,62.98 v5.41,62.9
  Top 0.406: L2.1 17.48,93.78 C2.+ | 17.03,93.4 C2.+ | C2.+ 17.49,93.04 v17.49,91.53 17.49,88.75 16.46,87.71 16.46,87.64 C4.1 | v14.58,40.78 14.58,39.98 14.58,39.97 | v16.21,71.73 16.21,71.56 15.12,70.47 C12.1 14.52,70.04 13.92,69.44 13.92,67.4 13.29,66.77 13.29,66.06 13.98,65.37 v13.98,64.53
  Bottom 0.203: v13.47,36.86 13.47,38.52 14.58,39.63 v14.58,40.78
  Bottom 0.356: 7.04,63.51 7.04,57.22 7.03,57.21
  Bottom 0.406: v14.58,40.78 14.58,42.02 11.11,45.49 11.11,53.13 7.03,57.21 | v16.21,71.73 16.21,72.16 16.68,72.63 16.68,90.72 v17.49,91.53 | v13.98,64.53 13.98,65.3 13.46,65.82 6.52,65.82 6.48,65.78 6.48,64.07 | v5.41,62.9 5.41,63.17 6.4,64.16 6.48,64.07 | 6.48,64.07 7.04,63.51
VEE  (via drill 0.4)
  Top 0.203: v4.64,37.61 4.65,37.61 5.43,36.83 6.39,36.83 7.14,37.58 C22.2 | C18.2 6.09,60.51 6.09,61.27 v6.18,61.36
  Top 0.254: IC5.4 8.37,37.9 7.51,37.9 7.21,37.6 C22.2 | IC4.11 6.61,64.16 6.04,63.6 5.99,63.6 | 17.57,64.27 IC3.11 | C15.2 18.4,64.27 IC3.11 | v3.78,64.79 4.04,64.79 5.14,63.68 5.9,63.68 5.99,63.6 | v6.18,61.36 6.18,62.05 6.19,62.06 6.19,63.4 5.99,63.6 | v14.15,66.42 15.01,65.56 15.01,64.49 15.22,64.27 IC3.11
  Top 0.406: R1.1 5.55,99.25 3.9,100.9 D2.A 3.9,101.38 2.96,100.44 2.21,100.44 L1.1 2.51,100.13 2.51,93.61 C3.- 2.24,92.04 v2.49,91.79 | v13.29,72.93 13.04,73.19 13.04,76.27 14.18,77.41 C10.2 14.88,77.41 IC2.9
  Bottom 0.203: v4.64,37.61 4.55,37.7 4.55,42.18 3.94,42.79 3.94,43.88 4.38,44.32 4.38,45.47 4.35,45.5 4.35,46.26 4.96,46.87 9.09,46.87 10.46,48.24 10.46,53.05 5.75,57.77 5.75,60.5 6.18,60.93 v6.18,61.36
  Bottom 0.406: v2.49,91.79 6.13,88.15 6.13,77.32 8.81,74.64 11.58,74.64 v13.29,72.93 13.38,72.93 14.49,71.82 14.49,66.76 v14.15,66.42 13.89,66.67 4.89,66.67 3.78,65.56 v3.78,64.79

### Text on the board
bNames: +12V | GND
tDocu: In | Out | Gnd | Gnd | VCA_2v_v1.0; Copyright forestcaver 2020